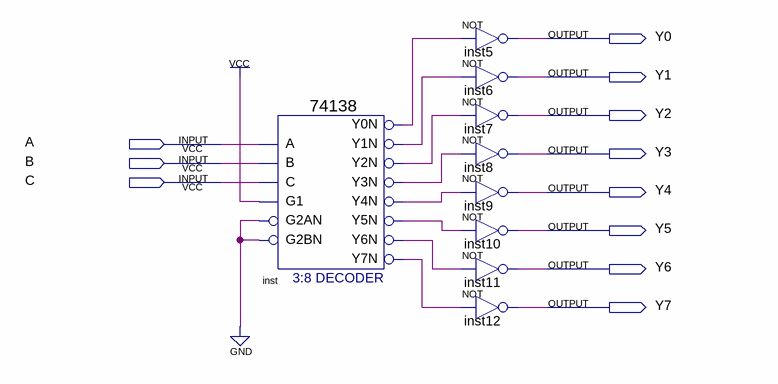
[diagram p0: schematic sheet]
// Quartus schematic 3-8.bdf as structural Verilog: 9 symbols, 11 pins
module \3-8  (
  input  A,
  input  B,
  input  C,
  output Y0,
  output Y1,
  output Y2,
  output Y3,
  output Y4,
  output Y5,
  output Y6,
  output Y7
);

  wire inst_y0n, inst_y1n, inst_y2n, inst_y3n, inst_y4n, inst_y5n, inst_y6n, inst_y7n;

  \74138  inst (
    .A(A), .B(B), .G1(1'b1), .C(C), .G2AN(1'b0), .G2BN(1'b0), .Y0N(inst_y0n), .Y1N(inst_y1n), .Y2N(inst_y2n),
    .Y3N(inst_y3n), .Y4N(inst_y4n), .Y5N(inst_y5n), .Y6N(inst_y6n), .Y7N(inst_y7n));
  not inst5 (Y0, inst_y0n);
  not inst6 (Y1, inst_y1n);
  not inst7 (Y2, inst_y2n);
  not inst8 (Y3, inst_y3n);
  not inst9 (Y4, inst_y4n);
  not inst10 (Y5, inst_y5n);
  not inst11 (Y6, inst_y6n);
  not inst12 (Y7, inst_y7n);
endmodule
